# Altium schematic sheet I2C-Isolator -  ISO1541.SchDoc
size A4
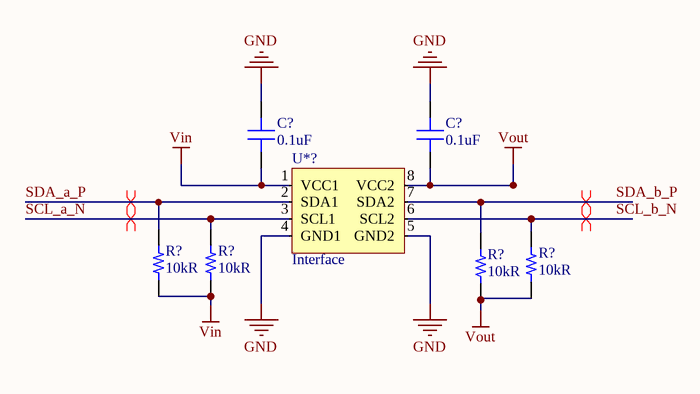
[diagram p0: I2C-Isolator -  ISO1541.SchDoc]

## Parts
(Parts that share a designator on the sheet are numbered #1, #2 ... from top to bottom, then left to right.)
C?#1  0.1uF  [CAP 0603_1608]
C?#2  0.1uF  [CAP 0603_1608]
R?#1  10kR  [RES 0603_1608]
R?#2  10kR  [RES 0603_1608]
R?#3  10kR  [RES 0603_1608]
R?#4  10kR  [RES 0603_1608]
U*?  Interface  [SOIC-8]

## Nets
GND: C?#1.2 C?#2.2 U*?.4(GND1) U*?.5(GND2)
Vin: C?#1.1 R?#1.1 R?#2.1 U*?.1(VCC1)
Vout: C?#2.1 R?#3.1 R?#4.1 U*?.8(VCC2)
SCL_a_N: R?#2.2 U*?.3(SCL1)
SCL_b_N: R?#3.2 U*?.6(SCL2)
SDA_a_P: R?#1.2 U*?.2(SDA1)
SDA_b_P: R?#4.2 U*?.7(SDA2)

## Layout directives
differential pair: SCL_a_N, SCL_b_N, SDA_a_P, SDA_b_P

## Library data of the parts
C?#1 C?#2 = C0603C104K5RACTU: KEMET - C0603C104K5RACTU - SMD Multilayer Cer; Dielectric Material: Ceramic; Capacitance: 100nF; Tolerance: 10%; Voltage Rating (DC): 50V; Dielectric: X7R; Part Number: C0603C104K5RACTU; Value: 0.1uF; Part Name: C0603C104K5RACTU; Supplier 1: Mouser; Supplier Part Number 1: 80-C0603C104K5R; Manufacturer: KEMET; Manufacturer Part Number: C0603C104K5RACTU; RoHS: Yes; Category: Ceramic Capacitors; Stock 1: 3092110; Pricing 1: 1=0.26000, 10=0.11800, 50=0.11800, 100=0.0730; Mount: Surface Mount; Case/Package: 0603; Case Code (Metric): 1608; Case Code (Imperial): 0603; Min Operating Temperature: -55°C; Max Operating Temperature: 125°C; Packaging: Tape and Reel; Package Quantity: 4000; Termination: SMD/SMT; Voltage: 50V; Length: 1.6mm; Width: 0.8mm; RoHS Compliant: Yes; ComponentLink1URL: https://datasheet.ciiva.com/29242/457901-da-0; ComponentLink1Description: https://datasheet.ciiva.com/29242/457901-da-0; Supplier 2: Mouser; Supplier Part Number 2: 80-C0603C104K5RAC; Stock 2: 377106; Pricing 2: 1=0.26000, 10=0.11800, 50=0.11800, 100=0.0730; Material: Ceramic
R?#1-R?#4 = TNPW060310K0BYEN: Res Thin Film 0603 10K Ohm 0.1% 1/10W 10ppm/C; Manufacturer: Vishay; Temperature Coefficient: 10ppm/°C; Power Rating: 100mW; Part Number: TNPW060310K0BYEN; Value: 10kR; Case/Package: 0603; Contact Plating: Tin; Part Name: TNPW060310K0BYEN; Supplier 1: Mouser; Supplier Part Number 1: 71-TNPW060310K0BYEN; Manufacturer Part Number: TNPW060310K0BYEN; RoHS: Yes; Category: Chip SMD Resistors; Stock 1: 3725; Pricing 1: 1=0.76000, 10=0.66000, 50=0.66000, 100=0.4600; Mount: Surface Mount; Min Operating Temperature: -55°C; Max Operating Temperature: 125°C; Resistance: 10kR; Tolerance: 0.1%; Resistor Type: Thin Film; Packaging: Tape and Reel; Construction: Rectangular; Technology: THIN FILM; Series: TNPW; Length: 1.6mm; Height: 0.45mm; Depth: 0.85mm; Radiation Hardening: No; Military Standard: Not; RoHS Compliant: Yes; ComponentLink1URL: https://datasheet.ciiva.com/11811/0900766b80d; ComponentLink1Description: https://datasheet.ciiva.com/11811/0900766b80d; ComponentLink2URL: https://datasheet.ciiva.com/9052/tnpw-e3-9052; ComponentLink2Description: https://datasheet.ciiva.com/9052/tnpw-e3-9052; ComponentLink3URL: https://datasheet.ciiva.com/17190/tnpw-e3-171; ComponentLink3Description: https://datasheet.ciiva.com/17190/tnpw-e3-171; Case Code (Imperial): 0603; Case Code (Metric): 1608
U*? = ISO1541QDRQ1: TEXAS INSTRUMENTS - ISO1541QDRQ1 . - DIGITAL ISOLATOR, 2-CH, WSOIC-8; Value: 8-pin; Part Number: ISO1541QDRQ1; Part Name: ISO1541QDRQ1; Supplier 1: Mouser; Supplier Part Number 1: 595-ISO1541QDRQ1; Manufacturer: Texas Instruments; Manufacturer Part Number: ISO1541QDRQ1; RoHS: Yes; Category: Integrated Circuits (ICs); Pricing 1: 1=5.21000, 10=4.69000, 50=4.43000, 100=3.8400; Mount: Surface Mount; Case/Package: SOIC; Number of Pins: 8; Min Operating Temperature: -40°C; Max Operating Temperature: 125°C